# Altium schematic sheet 07-SNESDRONE_Direct_IO_CART.SchDoc
size A4
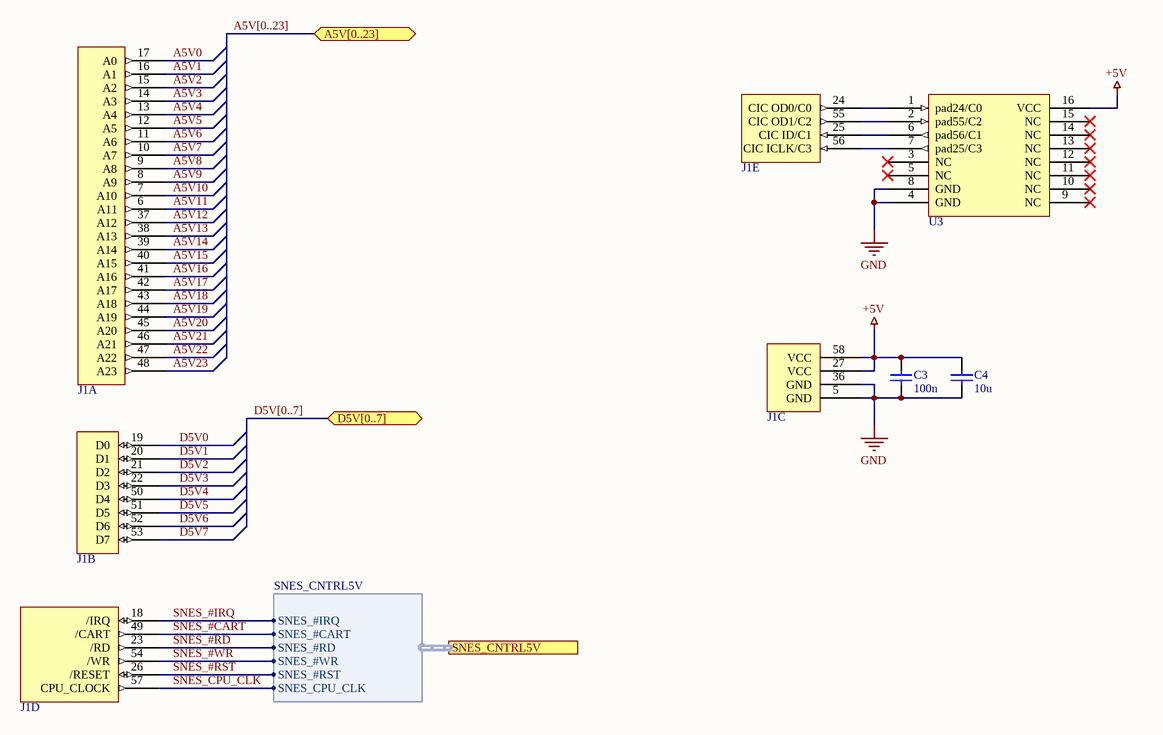
[diagram p0: 07-SNESDRONE_Direct_IO_CART.SchDoc]

## Parts
C3  value 100n  [cap_0603]  (hidden comment: cap_0603)
C4  value 10u  [cap_0603]  (hidden comment: cap_0603)
J1  SNES Cartridge Connector  [SNES Cartridge Connector]  (value not drawn)  (parts A,B,C,D,E of 5)  (net tie, no BOM)
U3  IC_D411A  [DIP16]  (value not drawn)  (net tie, no BOM)

## Ports
A5V[0..23] (bidir), D5V[0..7] (bidir), SNES_CNTRL5V (harness SNES_CNTRL5V)

## Harnesses
SNES_CNTRL5V: SNES_#IRQ, SNES_#CART, SNES_#RD, SNES_#WR, SNES_#RST, SNES_CPU_CLK

## Nets
+5V: C3.2 C4.2 J1.27(VCC) J1.58(VCC) U3.16(VCC)
GND: C3.1 C4.1 J1.5(GND) J1.36(GND) U3.4(GND) U3.8(GND)
A5V0: J1.17(A0)
A5V1: J1.16(A1)
A5V2: J1.15(A2)
A5V3: J1.14(A3)
A5V4: J1.13(A4)
A5V5: J1.12(A5)
A5V6: J1.11(A6)
A5V7: J1.10(A7)
A5V8: J1.9(A8)
A5V9: J1.8(A9)
A5V10: J1.7(A10)
A5V11: J1.6(A11)
A5V12: J1.37(A12)
A5V13: J1.38(A13)
A5V14: J1.39(A14)
A5V15: J1.40(A15)
A5V16: J1.41(A16)
A5V17: J1.42(A17)
A5V18: J1.43(A18)
A5V19: J1.44(A19)
A5V20: J1.45(A20)
A5V21: J1.46(A21)
A5V22: J1.47(A22)
A5V23: J1.48(A23)
D5V0: J1.19(D0)
D5V1: J1.20(D1)
D5V2: J1.21(D2)
D5V3: J1.22(D3)
D5V4: J1.50(D4)
D5V5: J1.51(D5)
D5V6: J1.52(D6)
D5V7: J1.53(D7)
SNES_#CART: J1.49(/CART) ; port SNES_CNTRL5V.SNES_#CART
SNES_#IRQ: J1.18(/IRQ) ; port SNES_CNTRL5V.SNES_#IRQ
SNES_#RD: J1.23(/RD) ; port SNES_CNTRL5V.SNES_#RD
SNES_#RST: J1.26(/RESET) ; port SNES_CNTRL5V.SNES_#RST
SNES_#WR: J1.54(/WR) ; port SNES_CNTRL5V.SNES_#WR
SNES_CPU_CLK: J1.57(CPU_CLOCK) ; port SNES_CNTRL5V.SNES_CPU_CLK
NetJ1_24: J1.24(CIC_OD0/C0) U3.1(pad24/C0)
NetJ1_25: J1.25(CIC_ID/C1) U3.6(pad56/C1)
NetJ1_55: J1.55(CIC_OD1/C2) U3.2(pad55/C2)
NetJ1_56: J1.56(CIC_ICLK/C3) U3.7(pad25/C3)

Not connected (* = marked no-connect by the designer): U3 3(NC)* 5(NC)* 9(NC)* 10(NC)* 11(NC)* 12(NC)* 13(NC)* 14(NC)* 15(NC)*

## Buses and harness runs
bus A5V[0..23] = port A5V[0..23]
bus D5V[0..7] = port D5V[0..7]

## Library data of the parts
C3 C4 = cap_0603: Capacitor
U3 = IC_D411A: SNES CIC Chip; ComponentLink1Description: info; ComponentLink1URL: https://wiki.superfamicom.org/cic